# Altium schematic sheet Board_Connect.SchDoc
size A4; SheetNumber: 10; SheetTotal: 10
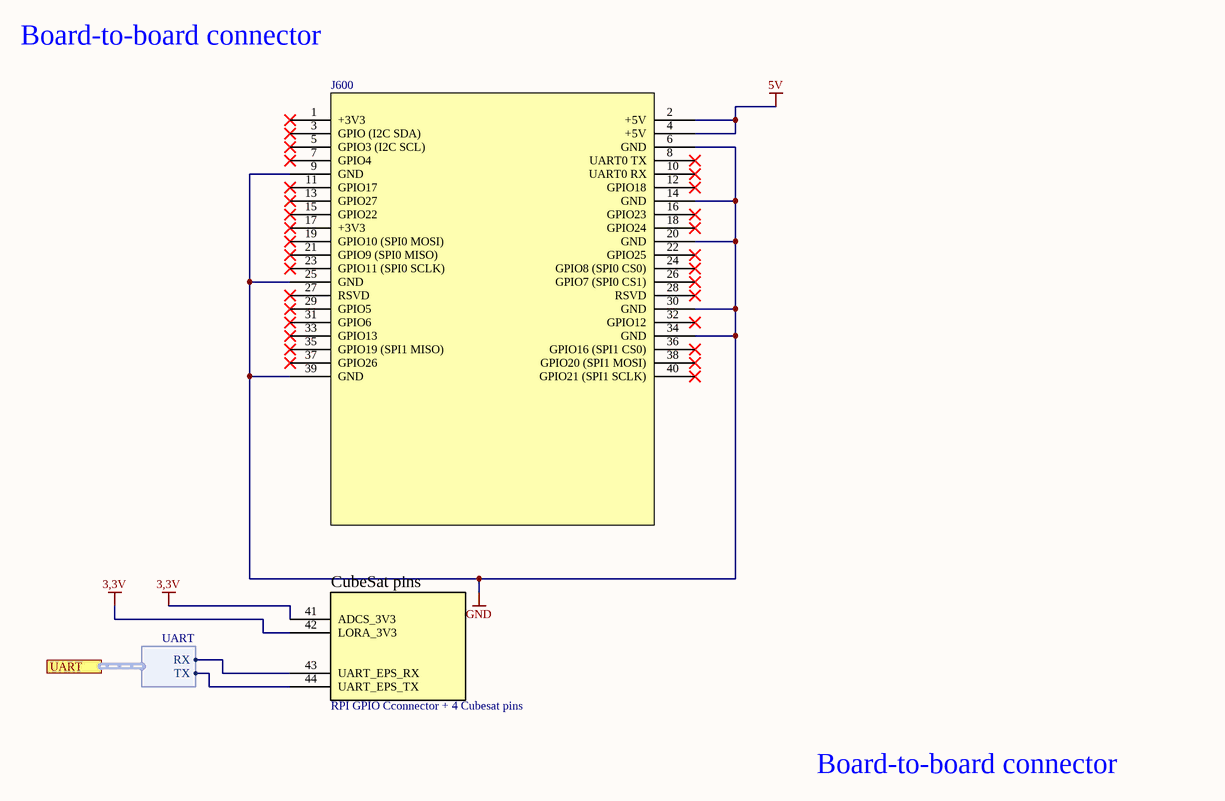
[diagram p0: Board_Connect.SchDoc]

## Parts
J600  RPI GPIO Cconnector + 4 Cubesat pins  [RPI GPIO]

## Ports
UART (harness UART, see 1[5C], 1[7B], 3[2C])

## Harnesses
UART: RX, TX

## Nets
3,3V: J600.41(ADCS_3V3) J600.42(LORA_3V3)
5V: J600.2(+5V) J600.4(+5V)
GND: J600.6(GND) J600.9(GND) J600.14(GND) J600.20(GND) J600.25(GND) J600.30(GND) J600.34(GND) J600.39(GND)
NetJ600_43: J600.43(UART_EPS_RX) ; port UART.RX
NetJ600_44: J600.44(UART_EPS_TX) ; port UART.TX

Not connected (* = marked no-connect by the designer): J600 1(+3V3)* 3(GPIO_(I2C_SDA))* 5(GPIO3_(I2C_SCL))* 7(GPIO4)* 8(UART0_TX)* 10(UART0_RX)* 11(GPIO17)* 12(GPIO18)* 13(GPIO27)* 15(GPIO22)* 16(GPIO23)* 17(+3V3)* 18(GPIO24)* 19(GPIO10_(SPI0_MOSI))* 21(GPIO9_(SPI0_MISO))* 22(GPIO25)* 23(GPIO11_(SPI0_SCLK))* 24(GPIO8_(SPI0_CS0))* 26(GPIO7_(SPI0_CS1))* 27(RSVD)* 28(RSVD)* 29(GPIO5)* 31(GPIO6)* 32(GPIO12)* 33(GPIO13)* 35(GPIO19_(SPI1_MISO))* 36(GPIO16_(SPI1_CS0))* 37(GPIO26)* 38(GPIO20_(SPI1_MOSI))* 40(GPIO21_(SPI1_SCLK))*

## Notes on the sheet
- Board-to-board connector
- (in symbol Connector GPIO) CubeSat pins

## Library data of the parts
J600 = Connector GPIO